# EAGLE schematic IntoBlue (EAGLE 7.4.0)
Interface to control McIntosh Labs audio equipment via RS232
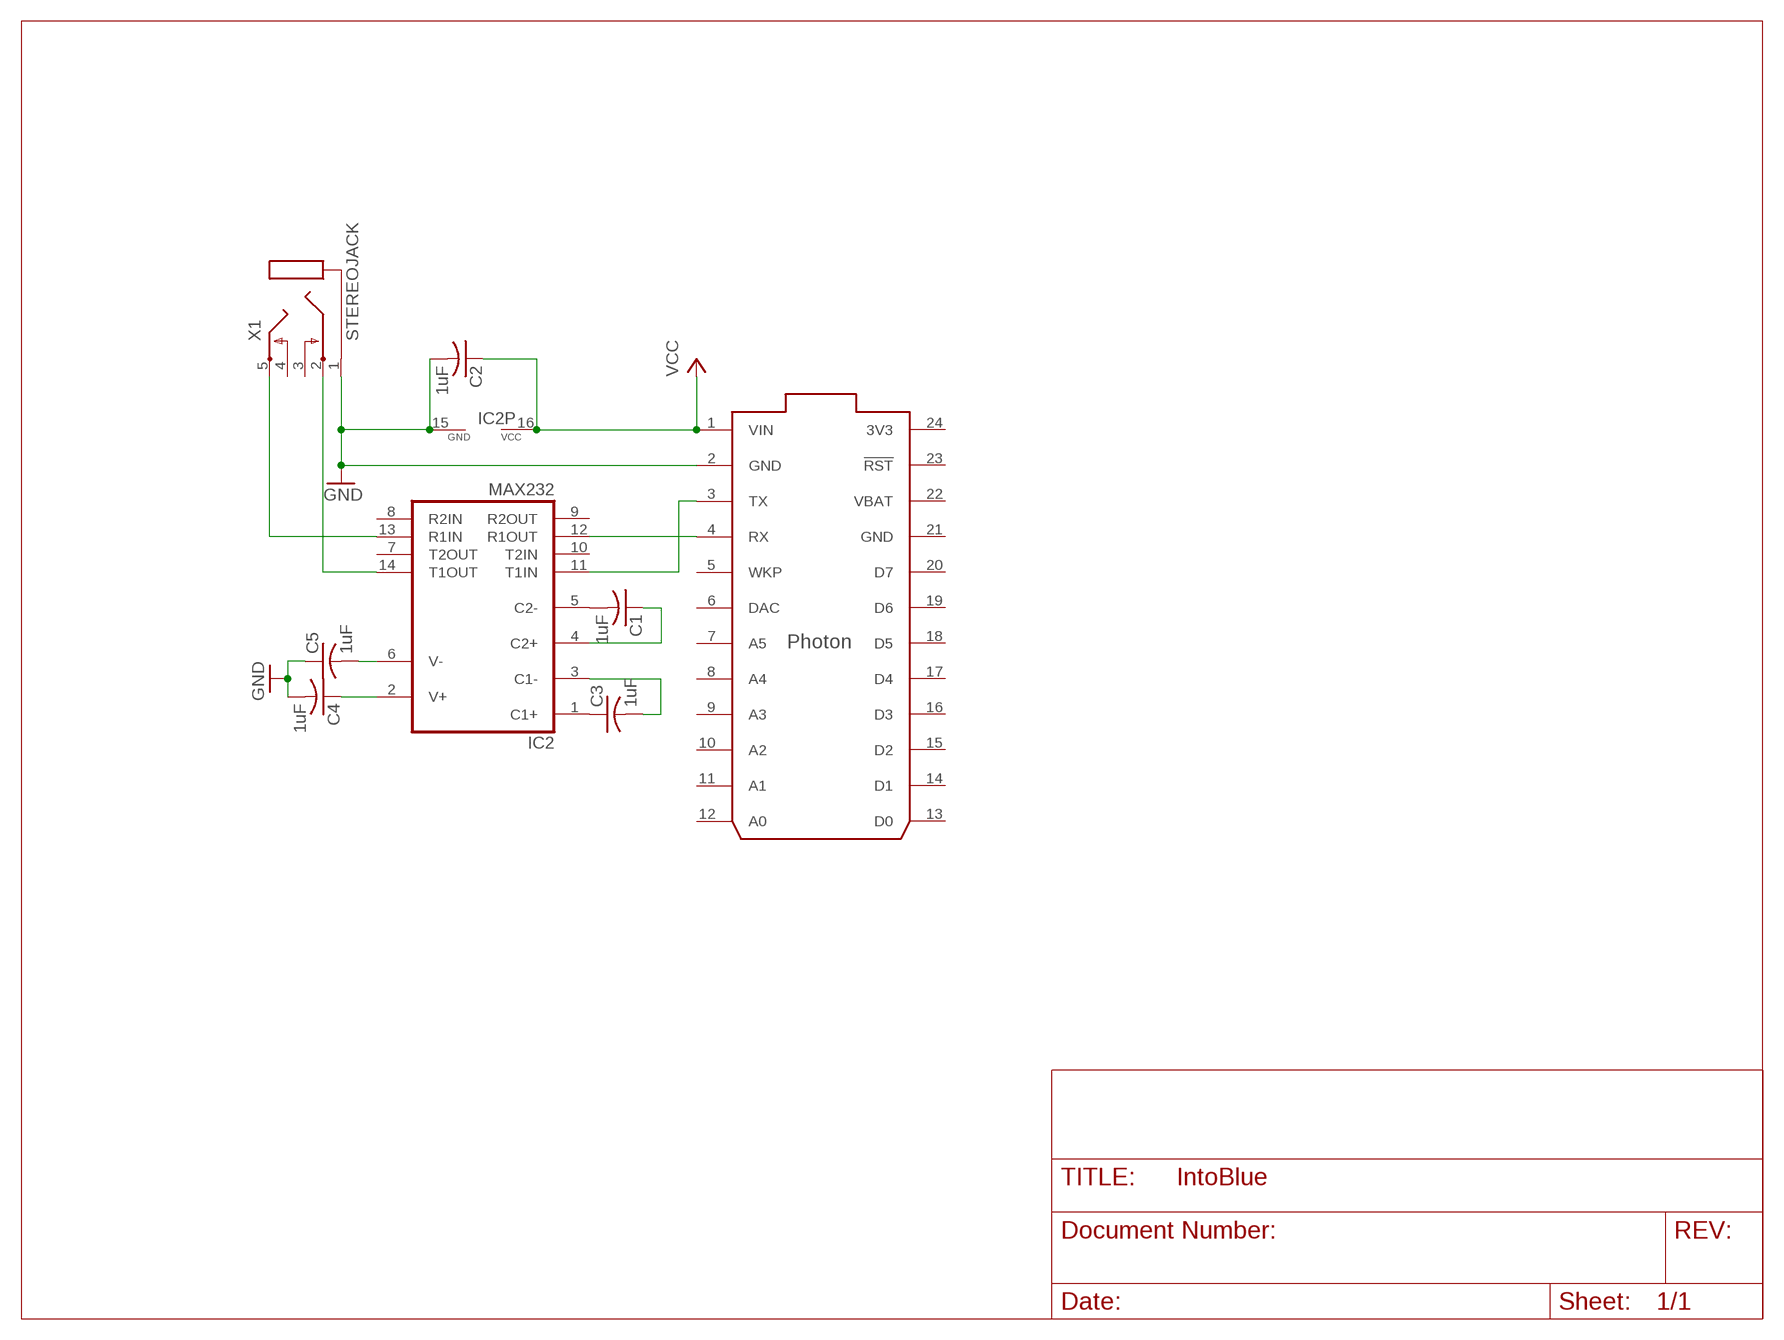
[diagram p0: schematic, sheet 1]

## Parts
C1  1uF  C-US050-025X075  [C050-025X075]
C2  1uF  C-US050-025X075  [C050-025X075]
C3  1uF  C-US050-025X075  [C050-025X075]
C4  1uF  C-US050-025X075  [C050-025X075]
C5  1uF  C-US050-025X075  [C050-025X075]
IC1  PHOTON_SMD  [PHOTON_SMD]
IC2  MAX232  [DIL16]
X1  STEREOJACK  [STX3100]

## Nets
GND: C2.2 C4.2 C5.1 IC1.2(GND) IC2.15(GND) X1.1
N$1: IC2.13(R1IN) X1.5
N$2: IC1.4(RX) IC2.12(R1OUT)
N$3: C3.1 IC2.1(C1+)
N$4: C4.1 IC2.2(V+)
N$5: IC1.3(TX) IC2.11(T1IN)
N$6: C1.2 IC2.5(C2-)
N$7: C1.1 IC2.4(C2+)
N$8: C3.2 IC2.3(C1-)
N$9: C5.2 IC2.6(V-)
N$10: IC2.14(T1OUT) X1.2
VCC: C2.1 IC1.1(VIN) IC2.16(VCC)
Unconnected: IC1.5(WKP) IC1.6(DAC) IC1.7(A5) IC1.8(A4) IC1.9(A3) IC1.10(A2) IC1.11(A1) IC1.12(A0) IC1.13(D0) IC1.14(D1) IC1.15(D2) IC1.16(D3) IC1.17(D4) IC1.18(D5) IC1.19(D6) IC1.20(D7) IC1.23(!RST) IC1.25(EN) IC1.26(!SETUP) IC1.27(RGB_RED) IC1.28(RGB_GREEN) IC1.29(RGB_BLUE) IC1.30(USB_D-) IC1.31(USB_D+) IC2.7(T2OUT) IC2.8(R2IN) IC2.9(R2OUT) IC2.10(T2IN) X1.3 X1.4

## Power pins joined to a net without a drawn wire
3V3: IC1.24(3V3)
GND: IC1.21(GND)
VBAT: IC1.22(VBAT)

## Library data of the parts
C1-C5 = adafruit:C-US: CAPACITOR, American symbol
IC1 = Spark:PHOTON_SMD: Photon (without headers) - designed to be surface mounted with 7 extra exposed pads on the bottom of the board which include, 3 RGB LED outputs, /SETUP, EN (3.3V SMPS enable input), USB D+ and USB D-.
IC2 = maxim:MAX232: RS232 TRANSCEIVER; MF: MAXIM; MPN: MAX232ACPE+; OC_FARNELL: 9723773; OC_NEWARK: 68K4544
X1 = adafruit:STEREOJACK: MIC/HEADPHONE JACK Stereo jack with two switches. Kycon STX3100, CUI SJ1-3555NG and/or 4UCon 05544